# Altium project finalproject.PrjPcb
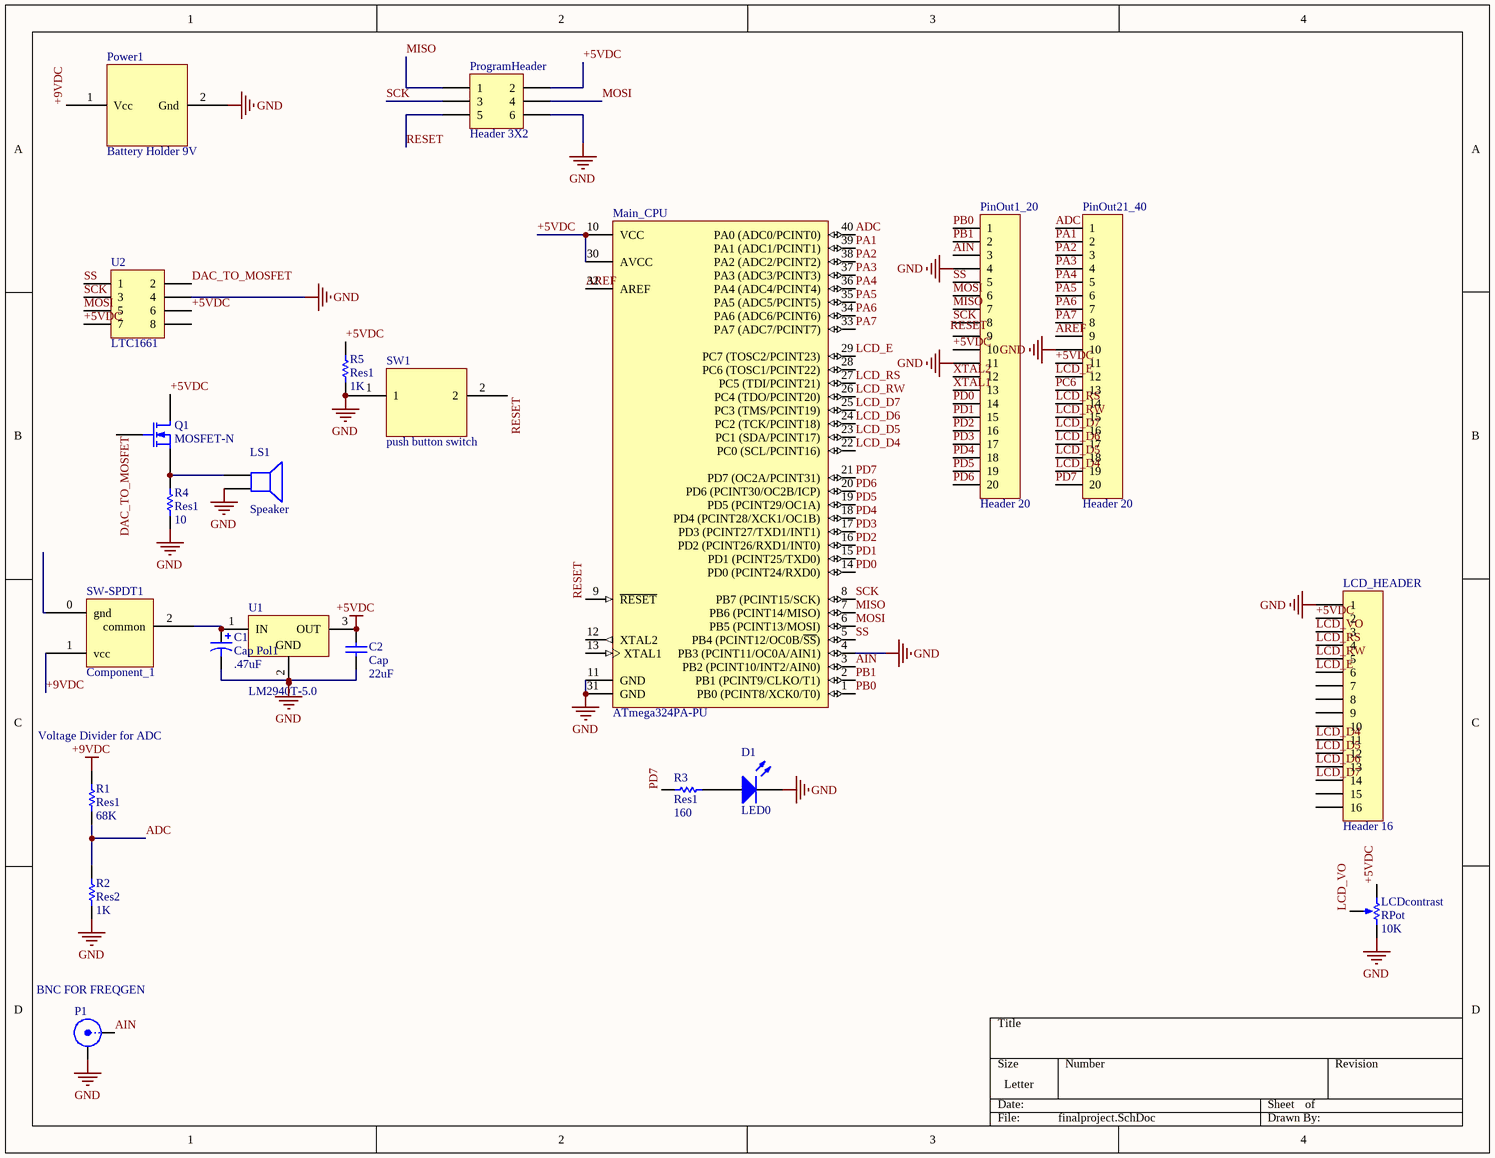
[diagram p0: finalproject.SchDoc]
1 sheet, 22 parts. Net scope: global (net labels, ports and power ports of the same name join across sheets).
Board files: finalproject_selfroute.PcbDoc, finalproject.PcbDoc

## Sheet finalproject.SchDoc
size Letter

### Parts
C1  Cap Pol1  value .47uF  [HDR1X2]
C2  Cap  value 22uF  [CSR13-D]
D1  LED0  [HDR1X2]
LCD_HEADER  Header 16  [HDR1X16]
LCDcontrast  RPot  value 10K  [VR5]
LS1  Speaker  [PIN2]
Main_CPU  ATmega324PA-PU  [40P6]
P1  BNC FOR FREQGEN  [BNC_RA CON]
PinOut1_20  Header 20  [HDR1X20]
PinOut21_40  Header 20  [HDR1X20]
Power1  Battery Holder 9V  [PCBComponent_1 - duplicate]
ProgramHeader  Header 3X2  [HDR2X3]
Q1  MOSFET-N  [HDR1X3]
R1  Res1  value 68K  [AXIAL-0.3]
R2  Res2  value 1K  [AXIAL-0.3]
R3  Res1  value 160  [AXIAL-0.3]
R4  Res1  value 10  [AXIAL-0.3]
R5  Res1  value 1K  [AXIAL-0.3]
SW1  push button switch  [SW-PUSH-4]
SW-SPDT1  Component_1  [PCBComponent_1]
U1  LM2940T-5.0  [T03B]
U2  LTC1661  [DIP-8]

### Nets
+5VDC: C2.2 LCD_HEADER.2 LCDcontrast.1(TOP) Main_CPU.10(VCC) Main_CPU.30(AVCC) PinOut1_20.10 PinOut21_40.11 ProgramHeader.2 Q1.1(D) R5.2 U1.3(OUT) U2.6 U2.7
+9VDC: Power1.1(Vcc) R1.2 SW-SPDT1.1(vcc)
GND: C1.2 C2.1 D1.2(K) LCD_HEADER.1 LCDcontrast.2(BOT) LS1.2 Main_CPU.4(PB3_(PCINT11/OC0A/AIN1)) Main_CPU.11(GND) Main_CPU.31(GND) P1.2(Y) PinOut1_20.4 PinOut1_20.11 PinOut21_40.10 Power1.2(Gnd) ProgramHeader.6 R2.1 R4.1 R5.1 SW1.1 U1.2(GND) U2.4
ADC: Main_CPU.40(PA0_(ADC0/PCINT0)) PinOut21_40.1 R1.1 R2.2
AIN: Main_CPU.3(PB2_(PCINT10/INT2/AIN0)) P1.1(X) PinOut1_20.3
AREF: Main_CPU.32(AREF) PinOut21_40.9
DAC_TO_MOSFET: Q1.2(G) U2.2
LCD_D4: LCD_HEADER.11 Main_CPU.22(PC0_(SCL/PCINT16)) PinOut21_40.19
LCD_D5: LCD_HEADER.12 Main_CPU.23(PC1_(SDA/PCINT17)) PinOut21_40.18
LCD_D6: LCD_HEADER.13 Main_CPU.24(PC2_(TCK/PCINT18)) PinOut21_40.17
LCD_D7: LCD_HEADER.14 Main_CPU.25(PC3_(TMS/PCINT19)) PinOut21_40.16
LCD_E: LCD_HEADER.6 Main_CPU.29(PC7_(TOSC2/PCINT23)) PinOut21_40.12
LCD_RS: LCD_HEADER.4 Main_CPU.27(PC5_(TDI/PCINT21)) PinOut21_40.14
LCD_RW: LCD_HEADER.5 Main_CPU.26(PC4_(TDO/PCINT20)) PinOut21_40.15
LCD_VO: LCD_HEADER.3 LCDcontrast.3(TAP)
MISO: Main_CPU.7(PB6_(PCINT14/MISO)) PinOut1_20.7 ProgramHeader.1
MOSI: Main_CPU.6(PB5_(PCINT13/MOSI)) PinOut1_20.6 ProgramHeader.4 U2.5
PA1: Main_CPU.39(PA1_(ADC1/PCINT1)) PinOut21_40.2
PA2: Main_CPU.38(PA2_(ADC2/PCINT2)) PinOut21_40.3
PA3: Main_CPU.37(PA3_(ADC3/PCINT3)) PinOut21_40.4
PA4: Main_CPU.36(PA4_(ADC4/PCINT4)) PinOut21_40.5
PA5: Main_CPU.35(PA5_(ADC5/PCINT5)) PinOut21_40.6
PA6: Main_CPU.34(PA6_(ADC6/PCINT6)) PinOut21_40.7
PA7: Main_CPU.33(PA7_(ADC7/PCINT7)) PinOut21_40.8
PB0: Main_CPU.1(PB0_(PCINT8/XCK0/T0)) PinOut1_20.1
PB1: Main_CPU.2(PB1_(PCINT9/CLKO/T1)) PinOut1_20.2
PC6: PinOut21_40.13
PD0: Main_CPU.14(PD0_(PCINT24/RXD0)) PinOut1_20.14
PD1: Main_CPU.15(PD1_(PCINT25/TXD0)) PinOut1_20.15
PD2: Main_CPU.16(PD2_(PCINT26/RXD1/INT0)) PinOut1_20.16
PD3: Main_CPU.17(PD3_(PCINT27/TXD1/INT1)) PinOut1_20.17
PD4: Main_CPU.18(PD4_(PCINT28/XCK1/OC1B)) PinOut1_20.18
PD5: Main_CPU.19(PD5_(PCINT29/OC1A)) PinOut1_20.19
PD6: Main_CPU.20(PD6_(PCINT30/OC2B/ICP)) PinOut1_20.20
PD7: Main_CPU.21(PD7_(OC2A/PCINT31)) PinOut21_40.20 R3.1
RESET: Main_CPU.9(~{RESET}) ProgramHeader.5 SW1.2
SCK: Main_CPU.8(PB7_(PCINT15/SCK)) PinOut1_20.8 ProgramHeader.3 U2.3
SS: Main_CPU.5(PB4_(PCINT12/OC0B/~{SS})) PinOut1_20.5 U2.1
XTAL1: PinOut1_20.13
XTAL2: PinOut1_20.12
NetC1_1: C1.1 SW-SPDT1.2(common) U1.1(IN)
NetD1_1: D1.1(A) R3.2
NetLS1_1: LS1.1 Q1.3(S) R4.2

Not connected (* = marked no-connect by the designer): LCD_HEADER 7 8 9 10 15 16; Main_CPU 12(XTAL2) 13(XTAL1) 28(PC6_(TOSC1/PCINT22)); PinOut1_20 9; Power1 3(NC); SW-SPDT1 0(gnd) 3(NC); U2 8

### Notes on the sheet
- (near R1) Voltage Divider for ADC
- Labels drawn without touching a wire or pin: RESET

### Library data of the parts
C1 = Cap Pol1: Polarized Capacitor (Radial); Published: 8-Jun-2000; LatestRevisionDate: 17-Jul-2002; LatestRevisionNote: Re-released for DXP Platform.; PackageReference: RB7.6-15; Publisher: Altium Limited; PackageDescription: Polarized Capacitor (Radial); 2 Leads
C2 = Cap: Capacitor; Published: 8-Jun-2000; LatestRevisionDate: 17-Jul-2002; LatestRevisionNote: Re-released for DXP Platform.; PackageReference: RAD-0.3; Publisher: Altium Limited; PackageDescription: Radial Cap, Thru-Hole; 2 Leads; 0.3 in Pin Spacing
D1 = LED0: Typical INFRARED GaAs LED; Published: 8-Jun-2000; LatestRevisionDate: 08-Jul-2005; LatestRevisionNote: Mech Layer 1 removed.; PackageReference: LED-0; Publisher: Altium Limited; PackageDescription: LED; 2 Leads
LCD_HEADER = Header 16: Header, 16-Pin; LatestRevisionDate: 17-Jul-2002; LatestRevisionNote: Re-released for DXP Platform.; Publisher: Altium Limited
LCDcontrast = RPot: Potentiometer; pin to pad: 2>3 3>2; Sim Note: Enter the Resistance value and the set point into parameter fields.; Set Position: 0.5; Published: 8-Jun-2000; LatestRevisionDate: 17-Jul-2002; LatestRevisionNote: Re-released for DXP Platform.; PackageReference: VR5; Publisher: Altium Limited; PackageDescription: Variable Resistor, Thru-Hole; 3 Leads
LS1 = Speaker: Loudspeaker; Published: 24-Mar-1999; LatestRevisionDate: 17-Jul-2002; LatestRevisionNote: Re-released for DXP Platform.; PackageReference: PIN2; Publisher: Altium Limited
Main_CPU = ATmega324PA-PU: 8-bit AVR Microcontroller, 32KB Flash, 1KB EEPROM, 2KB SRAM, 40-pin PDIP, Industrial Grade (-40°C to 85°C); Published: 1-Apr-2010; DatasheetVersion: revA, Jan-2010; PackageVersion: revB, Sep-2001; PackageReference: 40P6; Publisher: Altium Limited; PackageDescription: 40-lead (0.600"/15.24mm Wide) Plastic Dual Inline Package (PDIP); Supplier 1: Digi-Key; Supplier Part Number 1: ATMEGA324PA-PU-ND; Supplier 2: Farnell; Supplier Part Number 2: 1715485; Supplier 3: Mouser; Supplier Part Number 3: 556-ATMEGA324PA-PU; Code_JEDEC: MS-011-AC; ComponentLink1Description: Manufacturer Link; ComponentLink1URL: http://www.atmel.com/products/avr/default.asp?; ComponentLink2Description: ATmega164A/164PA/324A/324PA/644A/644PA/1284/1284P Datasheet; ComponentLink2URL: http://www.atmel.com/dyn/resources/prod_documents/doc8272.pdf; ComponentLink3Description: ATmega164A/164PA/324A/324PA/644A/644PA/1284/1284P Summary; ComponentLink3URL: http://www.atmel.com/dyn/resources/prod_documents/8272S.pdf; ComponentLink4Description: Atmel.com Home; ComponentLink4URL: http://www.atmel.com
P1 = BNC: BNC Elbow Connector; LatestRevisionDate: 17-Jul-2002; LatestRevisionNote: Re-released for DXP Platform.; Publisher: Altium Limited
PinOut1_20 PinOut21_40 = Header 20: Header, 20-Pin; LatestRevisionDate: 17-Jul-2002; LatestRevisionNote: Re-released for DXP Platform.; Publisher: Altium Limited
ProgramHeader = Header 3X2: Header, 3-Pin, Dual row; LatestRevisionDate: 17-Jul-2002; LatestRevisionNote: Re-released for DXP Platform.; Publisher: Altium Limited
Q1 = MOSFET-N: N-Channel MOSFET; Published: 8-Jun-2000; LatestRevisionDate: 17-Jul-2002; LatestRevisionNote: Re-released for DXP Platform.; PackageVersion: 1995/1996; PackageReference: E3; Publisher: Altium Limited; PackageDescription: TO, Flat Index; 3 In-Line, Axial Leads; Body Dia. 4.6mm; Lead Dia. 0.5 mm (max)
R1-R5 = Res1: Resistor; Published: 8-Jun-2000; LatestRevisionDate: 17-Jul-2002; LatestRevisionNote: Re-released for DXP Platform.; PackageReference: AXIAL-0.3; Publisher: Altium Limited; PackageDescription: Axial Device, Thru-Hole; 2 Leads; 0.3 in Pin Spacing
SW1 = SW-PUSH
U1 = LM2940T-5.0: 1A Low Dropout Regulator, 3-pin TO-220; Manufacturer: National Semiconductor; PackageTopMarking: NSUZXYTTE#*LM2940T*-5.0 P+; PowerWise: N; CompType: LDO IC; Published: 4-Dec-2008; DatasheetVersion: Jan-2007; PackageVersion: revL, Jan-1992; PackageReference: T03B; Publisher: Altium Limited; PackageDescription: TO-220, Molded, 3 Lead, Straight; Supplier 1: Farnell; Supplier Part Number 1: 1523854; Supplier 2: Farnell; Supplier Part Number 2: 9490205; PartNumber: LM2940T-5.0; RoHS: N; PinCount: 3; ComponentLink1Description: LM2940 Datasheet; ComponentLink1URL: http://www.national.com/ds/LM/LM2940.pdf; ComponentLink2Description: LM2940 Web Page; ComponentLink2URL: http://www.national.com/pf/LM/LM2940.html; ComponentLink3Description: T03B Package Page; ComponentLink3URL: http://www.national.com/packaging/folders/t03b.html
U2 = Header 4X2: Header, 4-Pin, Dual row; LatestRevisionDate: 17-Jul-2002; LatestRevisionNote: Re-released for DXP Platform.; Publisher: Altium Limited